# Altium schematic sheet Voltage_Sense_0-30V.SchDoc
size A4; SheetNumber: 6; SheetTotal: 6
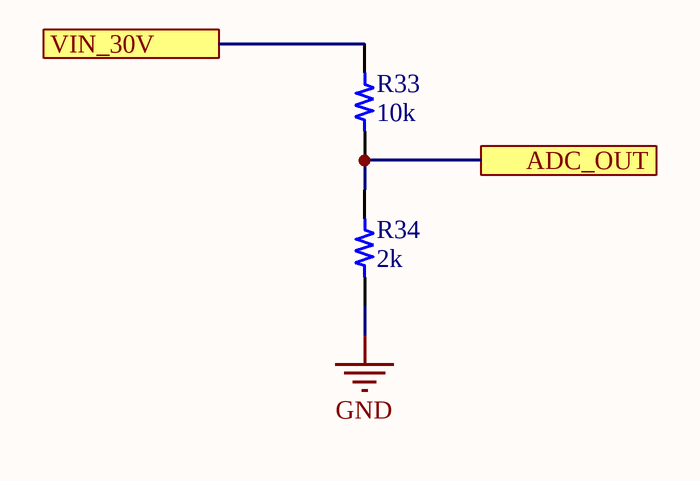
[diagram p0: Voltage_Sense_0-30V.SchDoc]

## Parts
R33  10k  [RES 1206_3216]
R34  2k  [RES 1206_3216]

## Ports
ADC_OUT, VIN_30V

## Nets
GND: R34.2
ADC_OUT: R33.2 R34.1 ; port ADC_OUT
VIN_30V: R33.1 ; port VIN_30V

## Library data of the parts
R33 R34 = RL1206FR-7W0R1L: RES 0.1 OHM 1% 1/2W 1206; Manufacturer: Yageo; Power (Watts): 0.5W, 1/2W; Resistance: 100 mOhms; Temperature Coefficient: ±600ppm/°C; Value: 100 mOhms; Part Number: RL1206FR-7W0R1L; ComponentLink1Description: Datasheet; ComponentLink1URL: http://www.yageo.com/documents/recent/PYu-RL_Group_521_RoHS_L_2.pdf; ComponentLink2Description: DigiKey Link; ComponentLink2URL: https://www.digikey.com/en/products/detail/yageo/RL1206FR-7W0R1L/2827682; Composition: Thick Film; Device Package: 1206 (3216 Metric); Features: Automotive AEC-Q200, Current Sense, Moisture Resistant; Height - Seated (Max): 0.026" (0.65mm); LastUpdated: 22.06.2022 13:26:42; Lifecycle Status: Active; Minimum Order: 1; Number of Terminations: 2; Operating Temperature: -55°C ~ 125°C; Package / Case: 1206 (3216 Metric); Packaging: TapeAndReel; PartId: 26837; Part Status: Active; Price: 0.10; Ratings: AEC-Q200; Series: RL; Size / Dimension: 0.122" L x 0.063" W (3.10mm x 1.60mm); Supplier 1: DigiKey; Supplier Part Number 1: 311-0.1LYCT-ND; Supplier Device Package: 1206; Tolerance: ±1%